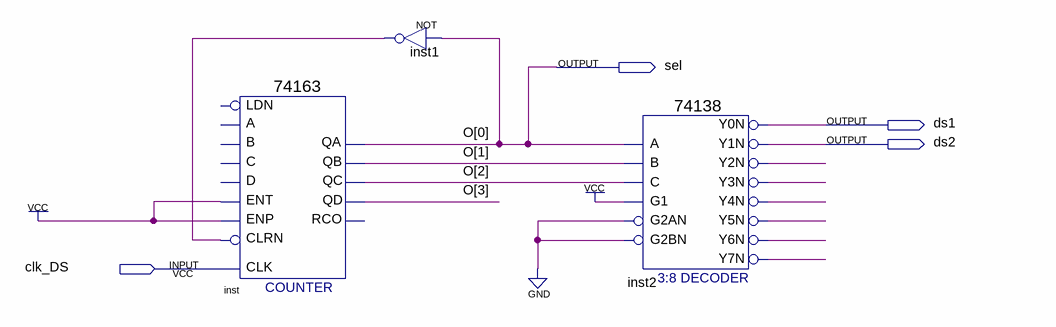
[diagram p0: schematic sheet]
// Quartus schematic dynamic_scanning.bdf as structural Verilog: 3 symbols, 4 pins
module dynamic_scanning (
  input  clk_DS,
  output sel,
  output ds1,
  output ds2
);

  wire inst1_out, inst2_y2n, inst2_y3n, inst2_y4n, inst2_y5n, inst2_y6n, inst2_y7n;
  wire [3:1] O;

  \74163  inst (
    .ENT(1'b1), .CLRN(inst1_out), .CLK(clk_DS), .ENP(1'b1), .QA(sel), .QB(O[1]), .QC(O[2]), .QD(O[3]));  // open: C, B, A, D, LDN, RCO
  not inst1 (inst1_out, sel);
  \74138  inst2 (
    .A(sel), .B(O[1]), .G1(1'b1), .C(O[2]), .G2AN(1'b0), .G2BN(1'b0), .Y0N(ds1), .Y1N(ds2), .Y2N(inst2_y2n),
    .Y3N(inst2_y3n), .Y4N(inst2_y4n), .Y5N(inst2_y5n), .Y6N(inst2_y6n), .Y7N(inst2_y7n));

  // Other names for the same wires on the sheet: O[0] = sel
endmodule
